# EAGLE design conbrio-nano-11-1-21 (EAGLE 9.6.2)
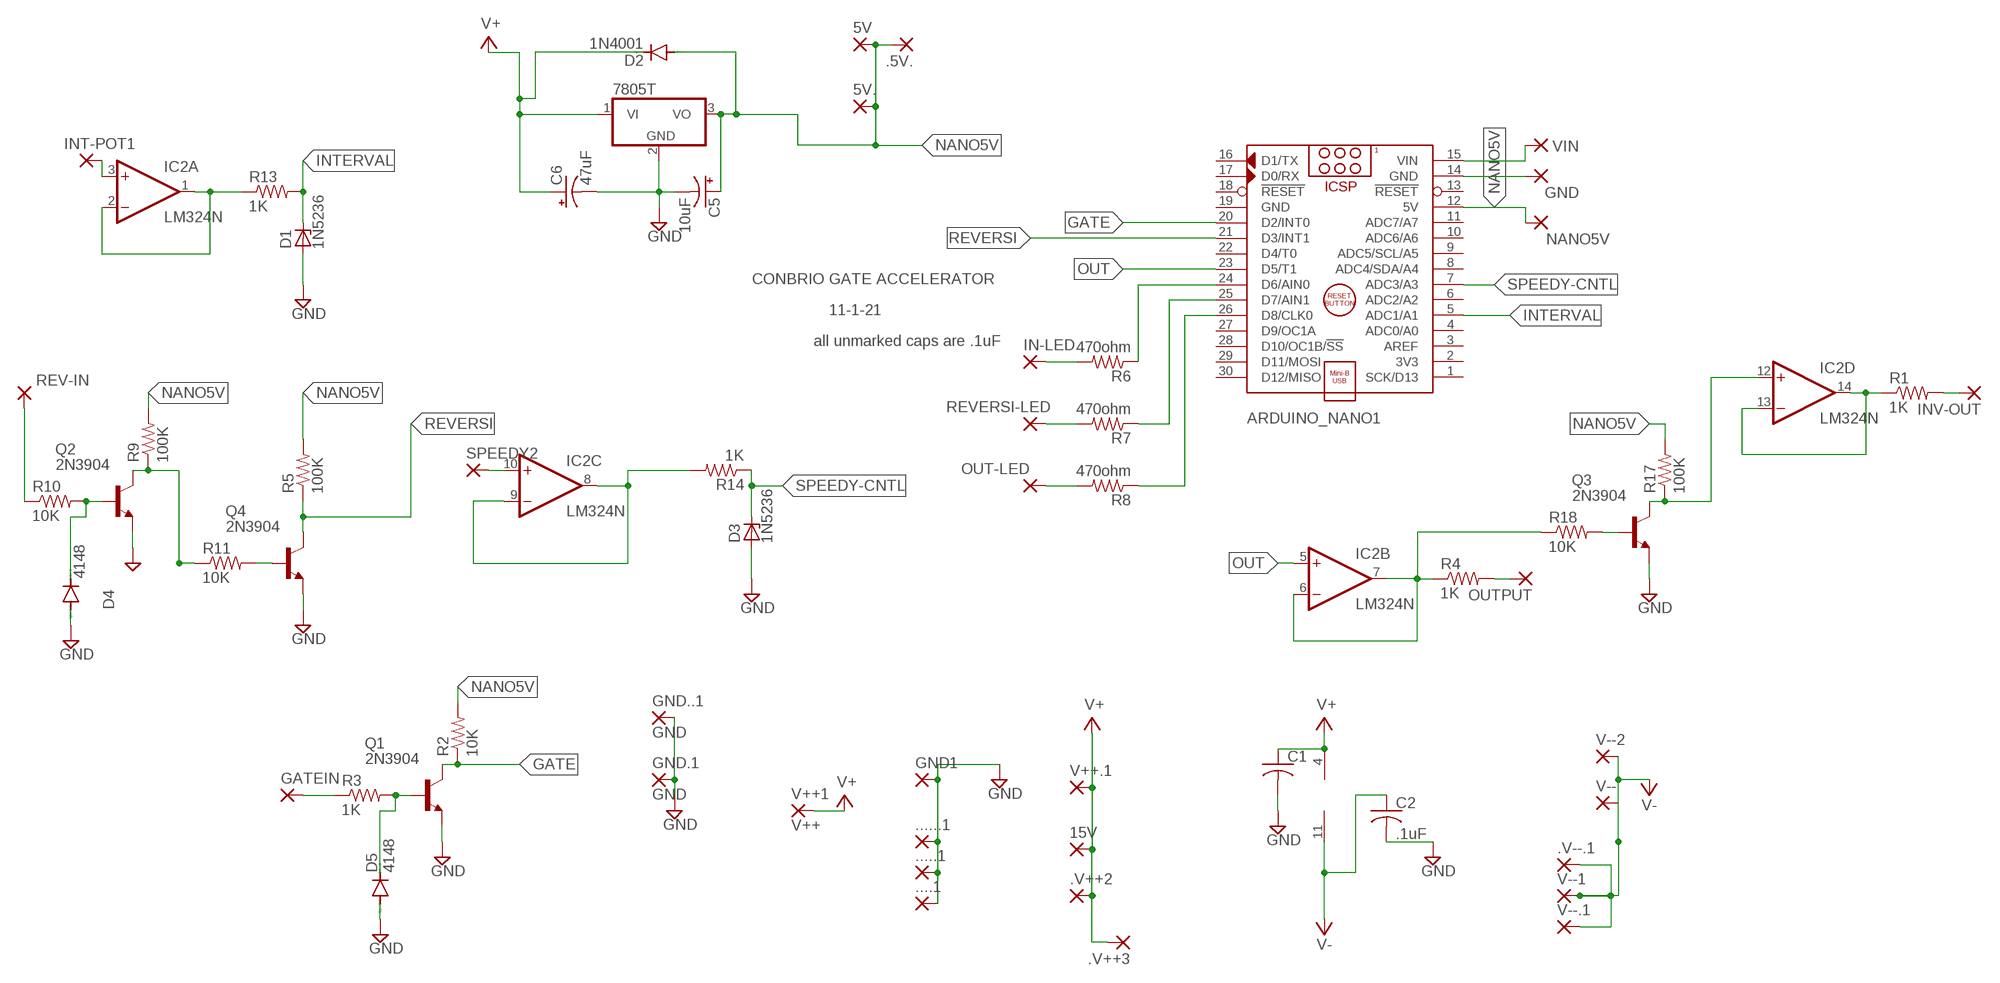
[diagram p0: schematic, sheet 1]

## Parts
5V  WIREPAD3,17/1,3  [3,17/1,3]
5V.  WIREPAD3,17/1,2  [3,17/1,2]
15V  2,54/1,0  [2,54/1,0]
7805  7805T  [TO220H]
.5V.  WIREPAD3,17/1,3  [3,17/1,3]
....1  3,17/1,3  [3,17/1,3]
.....1  3,17/1,3  [3,17/1,3]
......1  3,17/1,3  [3,17/1,3]
.V++2  2,54/1,0  [2,54/1,0]
.V++3  2,54/1,0  [2,54/1,0]
.V--.1  3,17/1,3  [3,17/1,3]
ARDUINO_NANO1  ARDUINO_NANO  [ARDUINO_NANO]
C1  C-US025-030X050  [C025-030X050]
C2  .1uF  C-US025-025X050  [C025-025X050]
C5  10uF  CPOL-USE3.5-10  [E3,5-10]
C6  47uF  CPOL-USE3.5-10  [E3,5-10]
D1  1N5236  ZENER-DIODEDO35Z10  [DO35Z10]
D2  1N4001  1N4148DO35-10  [DO35-10]
D3  1N5236  ZENER-DIODEDO35Z10  [DO35Z10]
D4  4148  1N4004  [DO41-10]
D5  4148  1N4004  [DO41-10]
GATEIN  3,17/1,3  [3,17/1,3]
GND  3,17/1,3  [3,17/1,3]
GND1  3,17/1,3  [3,17/1,3]
GND.1  GND  1,6/0,8  [1,6/0,8]
GND..1  GND  1,6/0,8  [1,6/0,8]
IC2  LM324N  [DIL14]
IN-LED  3,17/1,3  [3,17/1,3]
INT-POT1  3,17/1,3  [3,17/1,3]
INV-OUT  3,17/1,3  [3,17/1,3]
NANO5V  3,17/1,3  [3,17/1,3]
OUT-LED  3,17/1,3  [3,17/1,3]
OUTPUT  3,17/1,3  [3,17/1,3]
Q1  2N3904  [TO92]
Q2  2N3904  [TO92]
Q3  2N3904  [TO92]
Q4  2N3904  [TO92]
R1  1K  R-US_0207/10  [0207/10]
R2  10K  R-US_0204/7  [0204/7]
R3  1K  R-US_0204/7  [0204/7]
R4  1K  R-US_0207/12  [0207/12]
R5  100K  R-US_0204/7  [0204/7]
R6  470ohm  R-US_0207/10  [0207/10]
R7  470ohm  R-US_0204/7  [0204/7]
R8  470ohm  R-US_0204/7  [0204/7]
R9  100K  R-US_0204/7  [0204/7]
R10  10K  R-US_0204/7  [0204/7]
R11  10K  R-US_0204/7  [0204/7]
R13  1K  R-US_0204/7  [0204/7]
R14  1K  R-US_0204/7  [0204/7]
R17  100K  R-US_0204/7  [0204/7]
R18  10K  R-US_0207/12  [0207/12]
REV-IN  3,17/1,3  [3,17/1,3]
REVERSI-LED  3,17/1,3  [3,17/1,3]
SPEEDY2  3,17/1,3  [3,17/1,3]
V++1  V++  1,6/0,8  [1,6/0,8]
V++.1  2,54/1,0  [2,54/1,0]
V--  WIREPAD3,17/1,1  [3,17/1,1]
V--1  3,17/1,3  [3,17/1,3]
V--2  WIREPAD1,6/0,8  [1,6/0,8]
V--.1  3,17/1,3  [3,17/1,3]
VIN  3,17/1,3  [3,17/1,3]

## Nets
GATE: ARDUINO_NANO1.20(D2/INT0) Q1.1(C) R2.1
GND: 7805.2(GND) ....1.1(P) .....1.1(P) ......1.1(P) C1.2 C2.2 C5.- C6.- D1.A D3.A D4.A D5.A GND1.1(P) GND.1.1(P) GND..1.1(P) Q1.3(E) Q2.3(E) Q3.3(E) Q4.3(E)
INTERVAL: ARDUINO_NANO1.5(ADC1/A1) D1.C R13.2
INVOUT: IC2.13(D:-IN) IC2.14(D:OUT) R1.1
N$1: GATEIN.1(P) R3.1
N$2: D5.C Q1.2(B) R3.2
N$3: INV-OUT.1(P) R1.2
N$4: Q2.1(C) R9.1 R11.1
N$5: OUTPUT.1(P) R4.2
N$6: IC2.3(A:+IN) INT-POT1.1(P)
N$7: Q4.2(B) R11.2
N$8: IC2.6(B:-IN) IC2.7(B:OUT) R4.1 R18.1
N$9: R10.1 REV-IN.1(P)
N$10: IN-LED.1(P) R6.2
N$11: ARDUINO_NANO1.24(D6/AIN0) R6.1
N$12: R7.2 REVERSI-LED.1(P)
N$13: ARDUINO_NANO1.25(D7/AIN1) R7.1
N$14: OUT-LED.1(P) R8.2
N$15: ARDUINO_NANO1.26(D8/CLK0) R8.1
N$16: IC2.12(D:+IN) Q3.1(C) R17.1
N$17: IC2.10(C:+IN) SPEEDY2.1(P)
N$18: D4.C Q2.2(B) R10.2
N$21: IC2.1(A:OUT) IC2.2(A:-IN) R13.1
N$22: Q3.2(B) R18.2
N$23: ARDUINO_NANO1.15(VIN) VIN.1(P)
N$24: ARDUINO_NANO1.14(GND) GND.1(P)
NANO5V: 5V.1(P) 5V..1(P) 7805.3(VO) .5V..1(P) ARDUINO_NANO1.12(5V) C5.+ D2.A NANO5V.1(P) R2.2 R5.2 R9.2 R17.2
OUT: ARDUINO_NANO1.23(D5/T1) IC2.5(B:+IN)
REVERSI: ARDUINO_NANO1.21(D3/INT1) Q4.1(C) R5.1
SPEEDY: IC2.8(C:OUT) IC2.9(C:-IN) R14.2
SPEEDY-CNTL: ARDUINO_NANO1.7(ADC3/A3) D3.C R14.1
V+: 15V.1(P) 7805.1(VI) .V++2.1(P) .V++3.1(P) C1.1 C6.+ D2.C IC2.4(P:V+) V++1.1(P) V++.1.1(P)
V-: .V--.1.1(P) C2.1 IC2.11(P:V-) V--1.1(P) V--2.1(P) V--.1(P) V--.1.1(P)
Unconnected: ARDUINO_NANO1.1(SCK/D13) ARDUINO_NANO1.2(3V3) ARDUINO_NANO1.3(AREF) ARDUINO_NANO1.4(ADC0/A0) ARDUINO_NANO1.6(ADC2/A2) ARDUINO_NANO1.8(ADC4/SDA/A4) ARDUINO_NANO1.9(ADC5/SCL/A5) ARDUINO_NANO1.10(ADC6/A6) ARDUINO_NANO1.11(ADC7/A7) ARDUINO_NANO1.13(!RESET) ARDUINO_NANO1.16(D1/TX) ARDUINO_NANO1.17(D0/RX) ARDUINO_NANO1.18(!RESET) ARDUINO_NANO1.22(D4/T0) ARDUINO_NANO1.27(D9/OC1A) ARDUINO_NANO1.28(D10/OC1B/!SS) ARDUINO_NANO1.29(D11/MOSI) ARDUINO_NANO1.30(D12/MISO)

## Notes on the sheet
- CONBRIO GATE ACCELERATOR
- 11-1-21
- all unmarked caps are .1uF

## Power pins joined to a net without a drawn wire
GND: ARDUINO_NANO1.19(GND)

## Library data of the parts
5V 5V. .5V. = wirepad:WIREPAD: Wire PAD connect wire on PCB
15V .V++2 .V++3 V++.1 = wirepad-NONAMES:2,54/1,0: THROUGH-HOLE PAD
7805 = linear:78*: Positive VOLTAGE REGULATOR Source: http://cache.national.com/ds/LM/LM78L05.pdf http://www.fairchildsemi.com/ds/LM/LM7805.pdf
....1 .....1 ......1 GATEIN GND GND1 IN-LED INT-POT1 INV-OUT NANO5V OUT-LED OUTPUT REV-IN REVERSI-LED SPEEDY2 VIN = wirepad:3,17/1,3: THROUGH-HOLE PAD
.V--.1 V--1 V--.1 = wirepad-NONAMES:3,17/1,3: THROUGH-HOLE PAD
ARDUINO_NANO1 = ArduinoNanoV30:ARDUINO_NANO: Arduino Nano V3.0 Module Overview: The Arduino Nano is a small, complete, and breadboard-friendly board based on the ATmega328 (Arduino Nano 3.x) or ATmega168 (Arduino Nano 2.x). It has more or less the same functionality of the Arduino Duemilanove, but in a different package. It lacks only a DC power jack, and works with a Mini-B USB cable instead of a standard one. The Nano was designed and is being produced by Gravitech <http://www.gravitech.us/arna30wiatp.html>. General specifications: Item Value Microcontroller Atmel ATmega168 or ATmega328 Operating Voltage (logic level) 5 V Input Voltage (recommended) 7-12 V Input Voltage (limits) 6-20 V Digital I/O Pins 14 (of which 6 provide PWM output) Analog Input Pins 8 DC Current per I/O Pin 40 mA Flash Memory 16 KB (ATmega168) or 32 KB (ATmega328) of which 2 KB used by bootloader SRAM 1 KB (ATmega168) or 2 KB (ATmega328) EEPROM 512 bytes (ATmega168) or 1 KB (ATmega328) Clock Speed 16 MHz Dimensions (Inches) 0.73" x 1.70" Dimensions (mm) 18mm x 45mm Overall height About 9 mm (not including pins) Weigth 5 g Power: The Arduino Nano can be powered via the Mini-B USB connection, 6-20V unregulated external power supply (pin 30), or 5V regulated external power supply (pin 27). The power source is automatically selected to the highest voltage source. Memory: The ATmega168 has 16 KB of flash memory for storing code (of which 2 KB is used for the bootloader); the ATmega328 has 32 KB, (also with 2 KB used for the bootloader). The ATmega168 has 1 KB of SRAM and 512 bytes of EEPROM (which can be read and written with the EEPROM library); the ATmega328 has 2 KB of SRAM and 1 KB of EEPROM. Input and Output: Each of the 14 digital pins on the Nano can be used as an input or output, using pinMode(), digitalWrite(), and digitalRead() functions. They operate at 5 volts. Each pin can provide or receive a maximum of 40 mA and has an internal pull-up resistor (disconnected by default) of 20-50 kOhms. In addition, some pins have specialized functions. Visit Arduino - ArduinoBoardNano <https://www.arduino.cc/en/Main/ArduinoBoardNano>
C1 C2 = adafruit:C-US: CAPACITOR, American symbol
C5 C6 = rcl:CPOL-US: POLARIZED CAPACITOR, American symbol; SPICEPREFIX: C
D1 D3 = diode:ZENER-DIODE: Z-Diode
D2 = diode:1N4148: DIODE high speed (Philips)
D4 D5 = diode:1N4004: DIODE general purpose rectifier, 1 A
GND.1 GND..1 V++1 = wirepad-NONAMES:1,6/0,8: THROUGH-HOLE PAD
IC2 = linear:LM324: OP AMP
Q1-Q4 = transistor-npn:2N3904: NPN Transistor
R1 R4 R6 R18 = adafruit:R-US_: RESISTOR, American symbol
R2 R3 R5 R7-R11 R13 R14 R17 = rcl:R-US_: RESISTOR, American symbol
V-- V--2 = wirepad-NONAMES:WIREPAD: Wire PAD connect wire on PCB

## Board
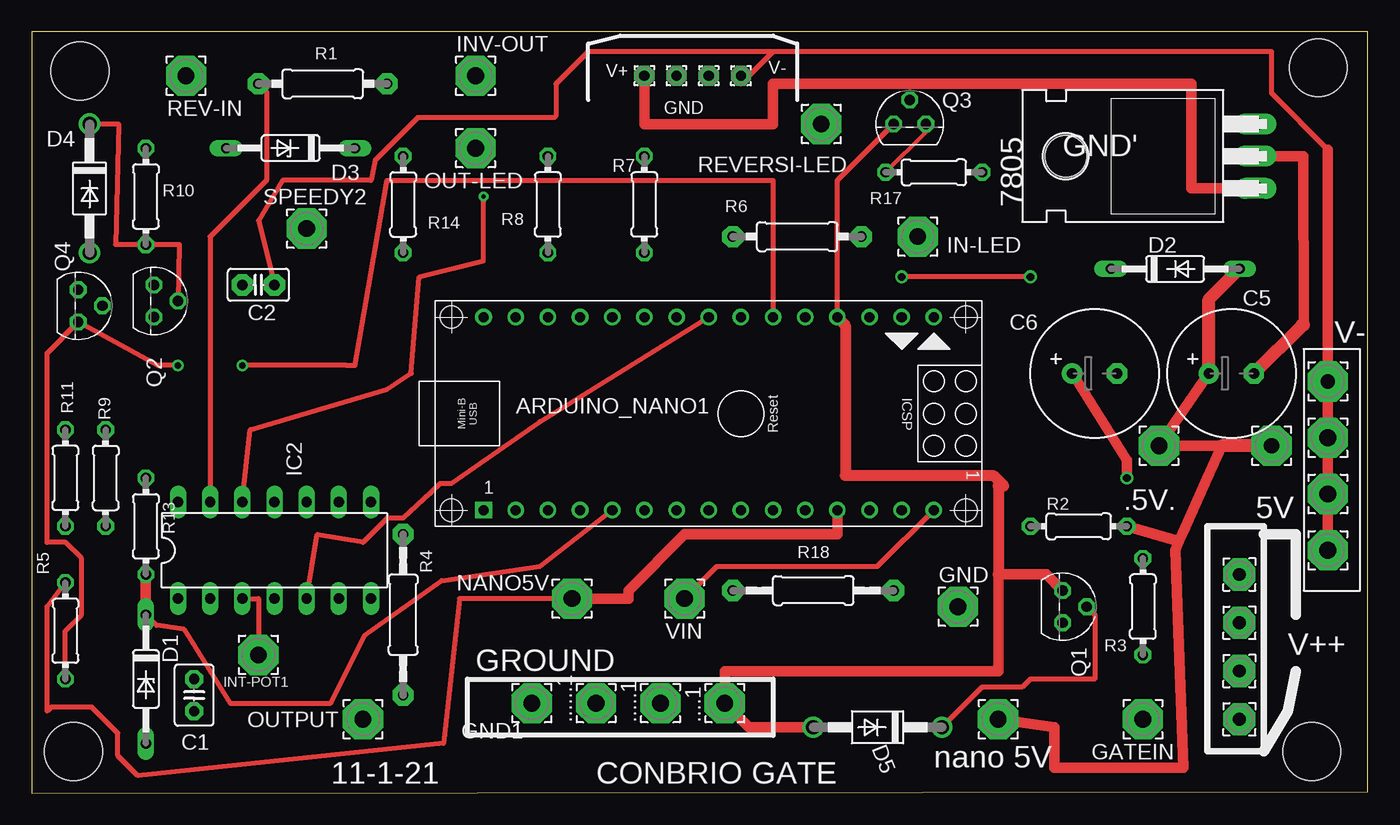
[diagram p1: board, top side]
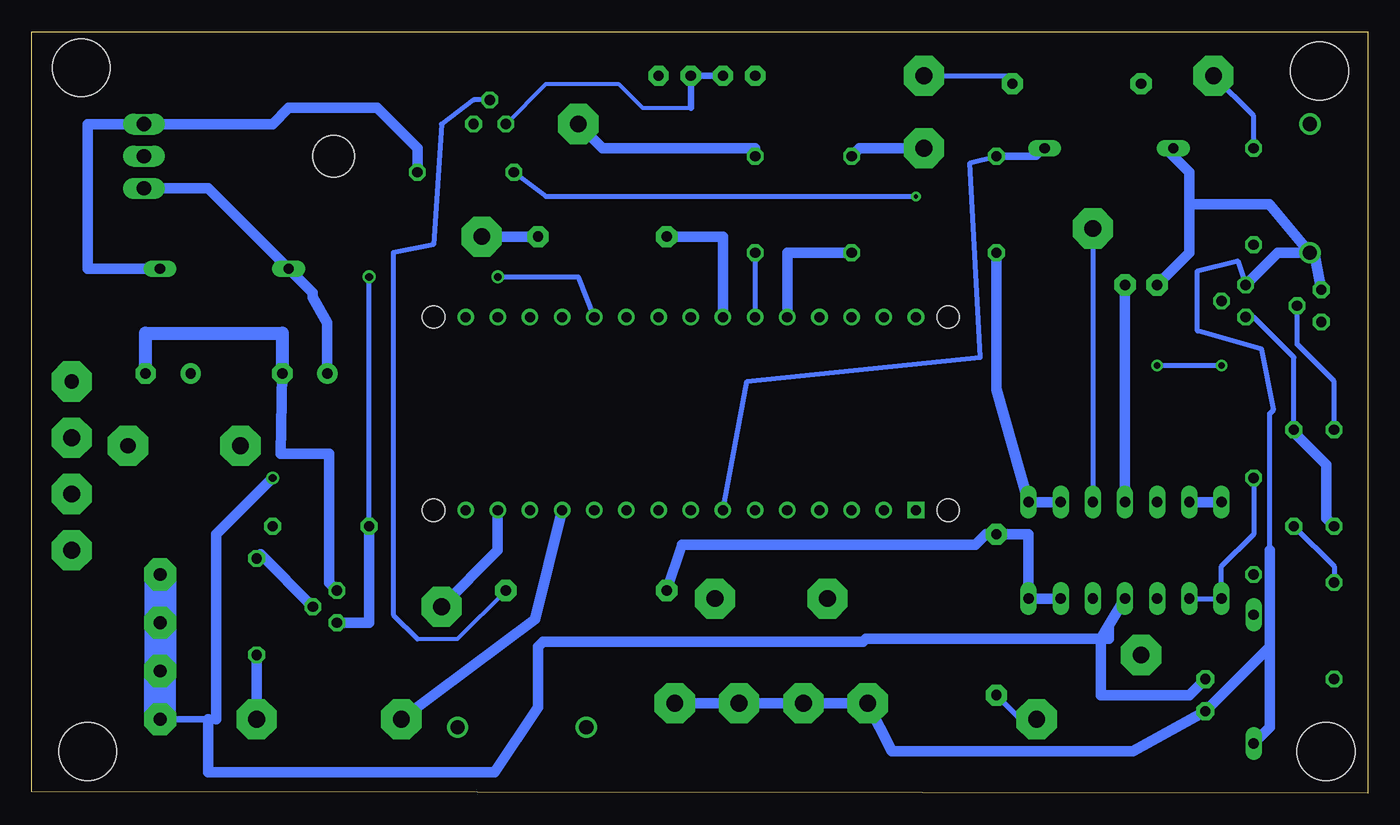
[diagram p2: board, bottom side, seen from below]

Size 105.52 x 60.12 mm. Coordinates in mm from the lower left corner, seen from the top.
Outline: 0,0 105.52,0.13 105.52,60.12 0,60.12 0,0
Copper layers (1*16): Top 0.035mm / dielectric 1.5mm / Bottom 0.035mm
Design rules "default": minimum track width 6mil, minimum drill 0.35mm, track to track 6mil, track to pad 6mil, pad to pad 6mil, via to via 6mil, smd to smd 6mil, copper to edge 40mil, drill to drill 6mil, minimum pad ring 10mil, minimum via ring 8mil, stop-mask expansion 4mil, vias tented up to drill 0mil, thermal gap 10mil
Holes 4.57 mm at 3.3,3.3 3.81,57.02 101.6,57.28 101.09,3.3

### Footprints (pad centres in the part's own frame; a part is rotated, then mirrored left to right if it is on the bottom)
3,17/1,3 = drill 1.321 pad 3.175 octagon: 1 0,0
3,17/1,2 = drill 1.194 pad 3.175 octagon: 1 0,0
2,54/1,0 = drill 1.016 pad 2.54 octagon: 1 0,0
TO220H = drill 1.118 long: 1 -2.54,-10.16; 2 0,-10.16; 3 2.54,-10.16 | hole 3.302: 0,4.826
ARDUINO_NANO = drill 0.8 square: 1 -20.32,-7.62 | drill 0.8: 2 -17.78,-7.62; 3 -15.24,-7.62; 4 -12.7,-7.62; 5 -10.16,-7.62; 6 -7.62,-7.62; 7 -5.08,-7.62; 8 -2.54,-7.62; 9 0,-7.62; 10 2.54,-7.62; 11 5.08,-7.62; 12 7.62,-7.62; 13 10.16,-7.62; 14 12.7,-7.62; 15 15.24,-7.62; 16 15.24,7.62; 17 12.7,7.62; 18 10.16,7.62; 19 7.62,7.62; 20 5.08,7.62; 21 2.54,7.62; 22 0,7.62; 23 -2.54,7.62; 24 -5.08,7.62; 25 -7.62,7.62; 26 -10.16,7.62; 27 -12.7,7.62; 28 -15.24,7.62; 29 -17.78,7.62; 30 -20.32,7.62 | hole 1.778: -22.86,-7.62; -22.86,7.62; 17.78,7.62; 17.78,-7.62
C025-030X050 = drill 0.813 pad 1.422 octagon: 1 -1.27,0; 2 1.27,0
C025-025X050 = drill 0.813 pad 1.676 octagon: 1 -1.27,0; 2 1.27,0
E3,5-10 = drill 0.813 pad 1.6: + -1.778,0 | drill 0.813 pad 1.6 octagon: - 1.778,0
DO35Z10 = drill 0.813 long: A 5.08,0; C -5.08,0
DO35-10 = drill 0.813 long: A 5.08,0; C -5.08,0
DO41-10 = drill 1.118: A 5.08,0; C -5.08,0
1,6/0,8 = drill 0.813 pad 1.6 octagon: 1 0,0
DIL14 = drill 0.813 long: 1 -7.62,-3.81; 2 -5.08,-3.81; 3 -2.54,-3.81; 4 0,-3.81; 5 2.54,-3.81; 6 5.08,-3.81; 7 7.62,-3.81; 8 7.62,3.81; 9 5.08,3.81; 10 2.54,3.81; 11 0,3.81; 12 -2.54,3.81; 13 -5.08,3.81; 14 -7.62,3.81
TO92 = drill 0.813 octagon: 1 1.27,0; 2 0,1.905; 3 -1.27,0
0207/10 = drill 0.813 pad 1.676 octagon: 1 -5.08,0; 2 5.08,0
0204/7 = drill 0.813 octagon: 1 -3.81,0; 2 3.81,0
0207/12 = drill 0.813 pad 1.676 octagon: 1 -6.35,0; 2 6.35,0
3,17/1,1 = drill 1.118 pad 3.175 octagon: 1 0,0

### Placement (x,y rotation side)
5V  76.33,5.84 0 top
5V.  97.92,27.43 180 top
15V  95.38,17.27 0 top
7805  86.49,50.29 90 top
.5V.  89.03,27.43 0 top
....1  54.74,7.11 90 top
.....1  49.66,7.11 90 top
......1  44.58,7.11 90 top
.V++2  95.38,13.46 0 top
.V++3  95.38,5.84 0 top
.V--.1  102.36,19.18 0 top
ARDUINO_NANO1  56.01,29.97 0 top
C1  12.83,7.75 270 top
C2  17.91,40.13 180 top
C5  94.74,33.15 0 top
C6  83.95,33.15 0 top
D1  9.02,9.02 270 top
D2  90.3,41.4 0 top
D3  20.45,50.93 180 top
D4  4.57,47.75 270 top
D5  66.8,5.21 180 top
GATEIN  87.76,5.84 0 top
GND  73.15,14.73 0 top
GND1  39.5,7.11 90 top
GND.1  53.47,56.64 0 top
GND..1  50.93,56.64 0 top
IC2  19.18,19.18 0 top
IN-LED  69.98,43.94 0 top
INT-POT1  17.91,10.92 0 top
INV-OUT  35.05,56.64 0 top
NANO5V  42.67,15.37 0 top
OUT-LED  35.05,50.93 0 top
OUTPUT  26.16,5.84 0 top
Q1  81.41,14.73 270 top
Q2  9.65,38.86 270 top
Q3  69.34,52.83 0 top
Q4  3.68,38.48 270 top
R1  22.99,56.01 0 top
R2  82.68,21.08 0 top
R3  87.76,14.73 90 top
R4  29.34,14.1 270 top
R5  2.67,12.83 90 top
R6  60.45,43.94 0 top
R7  48.39,46.48 90 top
R8  40.77,46.48 90 top
R9  5.84,24.89 270 top
R10  9.02,47.12 270 top
R11  2.67,24.89 90 top
R13  9.02,21.08 270 top
R14  29.34,46.48 270 top
R17  71.25,49.02 0 top
R18  61.72,16 0 top
REV-IN  12.19,56.64 0 top
REVERSI-LED  62.36,52.83 0 top
SPEEDY2  21.72,44.58 0 top
V++1  48.39,56.64 0 top
V++.1  95.38,9.65 0 top
V--  102.36,32.51 0 top
V--1  102.36,23.62 0 top
V--2  56.01,56.64 0 top
V--.1  102.36,28.07 0 top
VIN  51.56,15.37 0 top

### Tracks (layer width: path | path; a pad name or v marks a point on that pad's centre or on a via)
GATE  (via drill 0.6)
  Top 0.406: v78.87,40.77 v68.71,40.77
  Bottom 0.406: R2.1 v78.87,40.77 | v68.71,40.77 62.36,40.77 ARDUINO_NANO1.20
  Bottom 0.813: Q1.1 78.87,13.46 R2.1
GND
  Top 0.406: 76.77,24.26 76.33,24.26 | ARDUINO_NANO1.19 63.63,48.39 Q3.3
  Top 0.813: Q1.3 80.14,17.27 76.33,17.27 76.33,9.65 54.74,9.65 ....1.1 56.64,5.21 D5.A | 100.46,36.96 100.42,50.29 7805.2
  Top 0.864: ARDUINO_NANO1.19 64.26,36.96 64.26,25.1 75.93,25.1 76.77,24.26 | 76.33,24.26 76.33,17.27
  Top 1.016: 100.46,36.96 100.33,36.96 C5.-
  Bottom 0.305: Q3.3 64.9,56.01 59.18,56.01 57.28,54.1 53.47,54.1 | D3.A 16,50.93
  Bottom 0.406: 7.75,19.18 7.75,29.97 7.43,30.29 8.38,35.05 13.46,36.5 13.46,41.24 10.29,42.04 Q2.3
  Bottom 0.508: 53.47,54.1 GND.1.1 GND..1.1
  Bottom 0.813: ....1.1 .....1.1 ......1.1 GND1.1 37.59,3.3 18.54,3.3 C1.2 7.75,11.56 | C6.- 85.84,26.8 82.04,26.8 82.04,16.64 Q1.3 | 16,50.93 14.1,49.02 14.1,46.48 | Q4.3 4.14,42.24 D4.A | D4.A 7.8,46.48 14.1,46.48 | 14.1,46.48 14.1,42.67 C2.2 | Q2.3 7.11,42.67 D4.A | D1.A 7.75,5.21 7.75,11.56 | 7.75,11.56 7.75,19.18
  Bottom 1.016: C5.- 96.52,36.32 85.72,36.32 C6.-
INTERVAL
  Top 0.406: D1.C 9.86,13.25 12.03,12.94 15.67,7.11 23.62,7.11 26.3,12.47 32.35,16.8 40.13,17.91 ARDUINO_NANO1.5
  Top 0.813: D1.C R13.2
INVOUT
  Top 0.406: R1.1 18.54,55.37 18.54,48.39 14.1,43.94 IC2.13
  Bottom 0.813: IC2.13 IC2.14
N$1
  Bottom 0.813: GATEIN.1 R3.1
N$2
  Top 0.406: Q1.2 83.95,14.1 83.95,9.02 78.87,9.02 78.23,8.38 75.06,8.38 D5.C
  Bottom 0.813: R3.2 87.44,18.86 Q1.2
N$3
  Bottom 0.406: INV-OUT.1 28.1,56.64 R1.2
N$4
  Bottom 0.406: R9.1 5.84,34.42 9.02,37.59 Q2.1
  Bottom 0.813: R11.1 3.3,21.72 3.3,25.95 5.84,28.49 R9.1
N$5
  Bottom 0.406: OUTPUT.1 27.43,5.84 R4.2
N$6
  Top 0.406: IC2.3 17.91,15.37 INT-POT1.1
N$7
  Bottom 0.406: R11.2 2.67,32.51 5.59,35.43 Q4.2
N$8
  Bottom 0.813: IC2.6 IC2.7 26.8,20.45 R4.1 30.17,20.45 31,19.61 54.17,19.61 R18.1
N$9
  Bottom 0.406: R10.1 9.02,53.47 REV-IN.1
N$10
  Bottom 0.813: R6.2 IN-LED.1
N$11
  Bottom 0.813: ARDUINO_NANO1.24 50.93,43.94 R6.1
N$12
  Bottom 0.813: R7.2 48.39,50.93 60.45,50.93 REVERSI-LED.1
N$13
  Bottom 0.406: R7.1 ARDUINO_NANO1.25
N$14
  Bottom 0.813: R8.2 40.13,50.93 OUT-LED.1
N$15
  Bottom 0.813: ARDUINO_NANO1.26 45.85,42.67 R8.1
N$16  (via drill 0.35)
  Top 0.305: Q3.1 70.61,52.2 R17.1
  Top 0.406: IC2.12 17.27,28.7 28.07,31.88 29.97,33.15 30.61,40.77 35.69,42.04 v35.69,47.12
  Bottom 0.406: R17.1 64.9,47.12 v35.69,47.12
N$17
  Bottom 0.406: SPEEDY2.1 IC2.10
N$18
  Top 0.406: Q2.2 11.67,43.31 R10.2 6.63,43.31 6.87,52.83 D4.C
N$21
  Bottom 0.406: IC2.2 IC2.1 11.56,17.91 9.02,20.45 R13.1
N$22
  Bottom 0.305: 75.06,12.19 71.88,12.19 R18.2
  Bottom 0.406: Q3.2 70.61,54.74 73.15,52.83 73.79,43.31 76.96,42.67 76.96,14.1 75.06,12.19
N$23
  Top 0.406: ARDUINO_NANO1.15 66.8,17.91 54.1,17.91 VIN.1
N$24
  Bottom 0.813: ARDUINO_NANO1.14 68.71,19.18 GND.1
NANO5V
  Top 0.406: NANO5V.1 33.78,15.37 32.51,3.94 8.38,1.4 6.81,2.97 6.81,4.75 4.75,6.81 1.55,6.81 1.22,6.48 1.22,14.73 R5.2
  Top 0.813: NANO5V.1 47.12,15.37 47.12,16 51.56,20.45 63.63,20.45 ARDUINO_NANO1.12 | 5V.1 80.77,5.21 80.77,2.03 90.93,2.03 90.3,19.18 90.61,19.88 | 5V..1 .5V..1 C5.+ | 93.97,27.43 92.84,24.89 91.11,21 90.61,19.88 | 90.61,19.88 R2.2
  Top 1.016: 5V..1 93.97,27.43 | C5.+ 92.96,38.99 D2.A
  Bottom 0.406: R5.2 2.67,17.91 R9.2
  Bottom 0.813: D2.A 101.09,41.4 101.09,52.83 7805.3 86.49,52.83 85.22,54.1 78.23,54.1 75.06,50.93 R17.2 | 5V.1 65.78,13.75 ARDUINO_NANO1.12
OUT
  Top 0.406: IC2.5 22.56,20.41 26.16,19.81 28.07,21.72 29.34,21.72 31.48,23.67 32.27,24.46 33.15,24.46 40.13,29.34 ARDUINO_NANO1.23
REVERSI  (via drill 0.5)
  Top 0.406: R5.1 2.67,12.83 3.94,14.1 3.94,18.54 2.67,19.81 1.22,19.81 1.22,34.75 Q4.1 9.97,33.78 v11.56,33.78 | v16.64,33.78 24.89,33.78 25.53,33.78 28.07,48.39 58.55,48.39 ARDUINO_NANO1.21
  Bottom 0.406: v16.64,33.78 v11.56,33.78
SPEEDY
  Bottom 0.813: R14.2 29.34,31.88 IC2.8 IC2.9
SPEEDY-CNTL
  Bottom 0.406: ARDUINO_NANO1.7 49.02,32.51 30.61,34.42 31.41,49.77 R14.1
  Bottom 0.61: R14.1 26.16,50.29 D3.C
V+  (via drill 0.6)
  Top 0.813: v86.49,24.89 86.49,26.28 C6.+ | 7805.1 91.57,47.75 91.57,56.01 58.55,56.01 58.55,52.83 48.39,52.83 V++1.1
  Bottom 0.508: 90.93,5.84 91.57,5.84 .V++3.1
  Bottom 0.813: 90.93,5.84 90.93,20.45 v86.49,24.89 | 91.57,5.84 91.57,1.65 68.96,1.65 65.53,6.79 65.53,11.56 65.14,11.95 39.88,11.95 39.64,12.19 20.45,12.19 20.45,13.25 | 7805.1 91.57,47.75 D2.C 83.31,39.5 83.31,39.16 82.17,37.14 C6.+ | 20.45,13.25 21.08,12.19 21.08,7.75 14.1,7.75 C1.1 | 20.45,13.25 IC2.4
  Bottom 2.54: 15V.1 .V++2.1 V++.1.1 .V++3.1
V-
  Top 0.406: 58.55,58.55 56.01,56.01 V--2.1 | 102.36,50.8 97.92,55.24 97.92,58.55 58.55,58.55 | 58.55,58.55 43.94,58.55 41.4,56.01 41.4,53.47 41.28,53.34 30.48,53.34 27.13,49.99 26.8,48.39 19.81,48.39 17.91,45.21 C2.1
  Top 0.813: 102.36,50.8 V--.1 V--.1.1 V--1.1 .V--.1.1
  Bottom 0.813: IC2.11 C2.1

### Text on the board
tNames: V+ | V- | GND | GND' | R7 | V- | 5V | V++ | GROUND | nano 5V | 11-1-21 | CONBRIO GATE